# EAGLE design DevBCU_v1.0 (EAGLE 9.4.2)
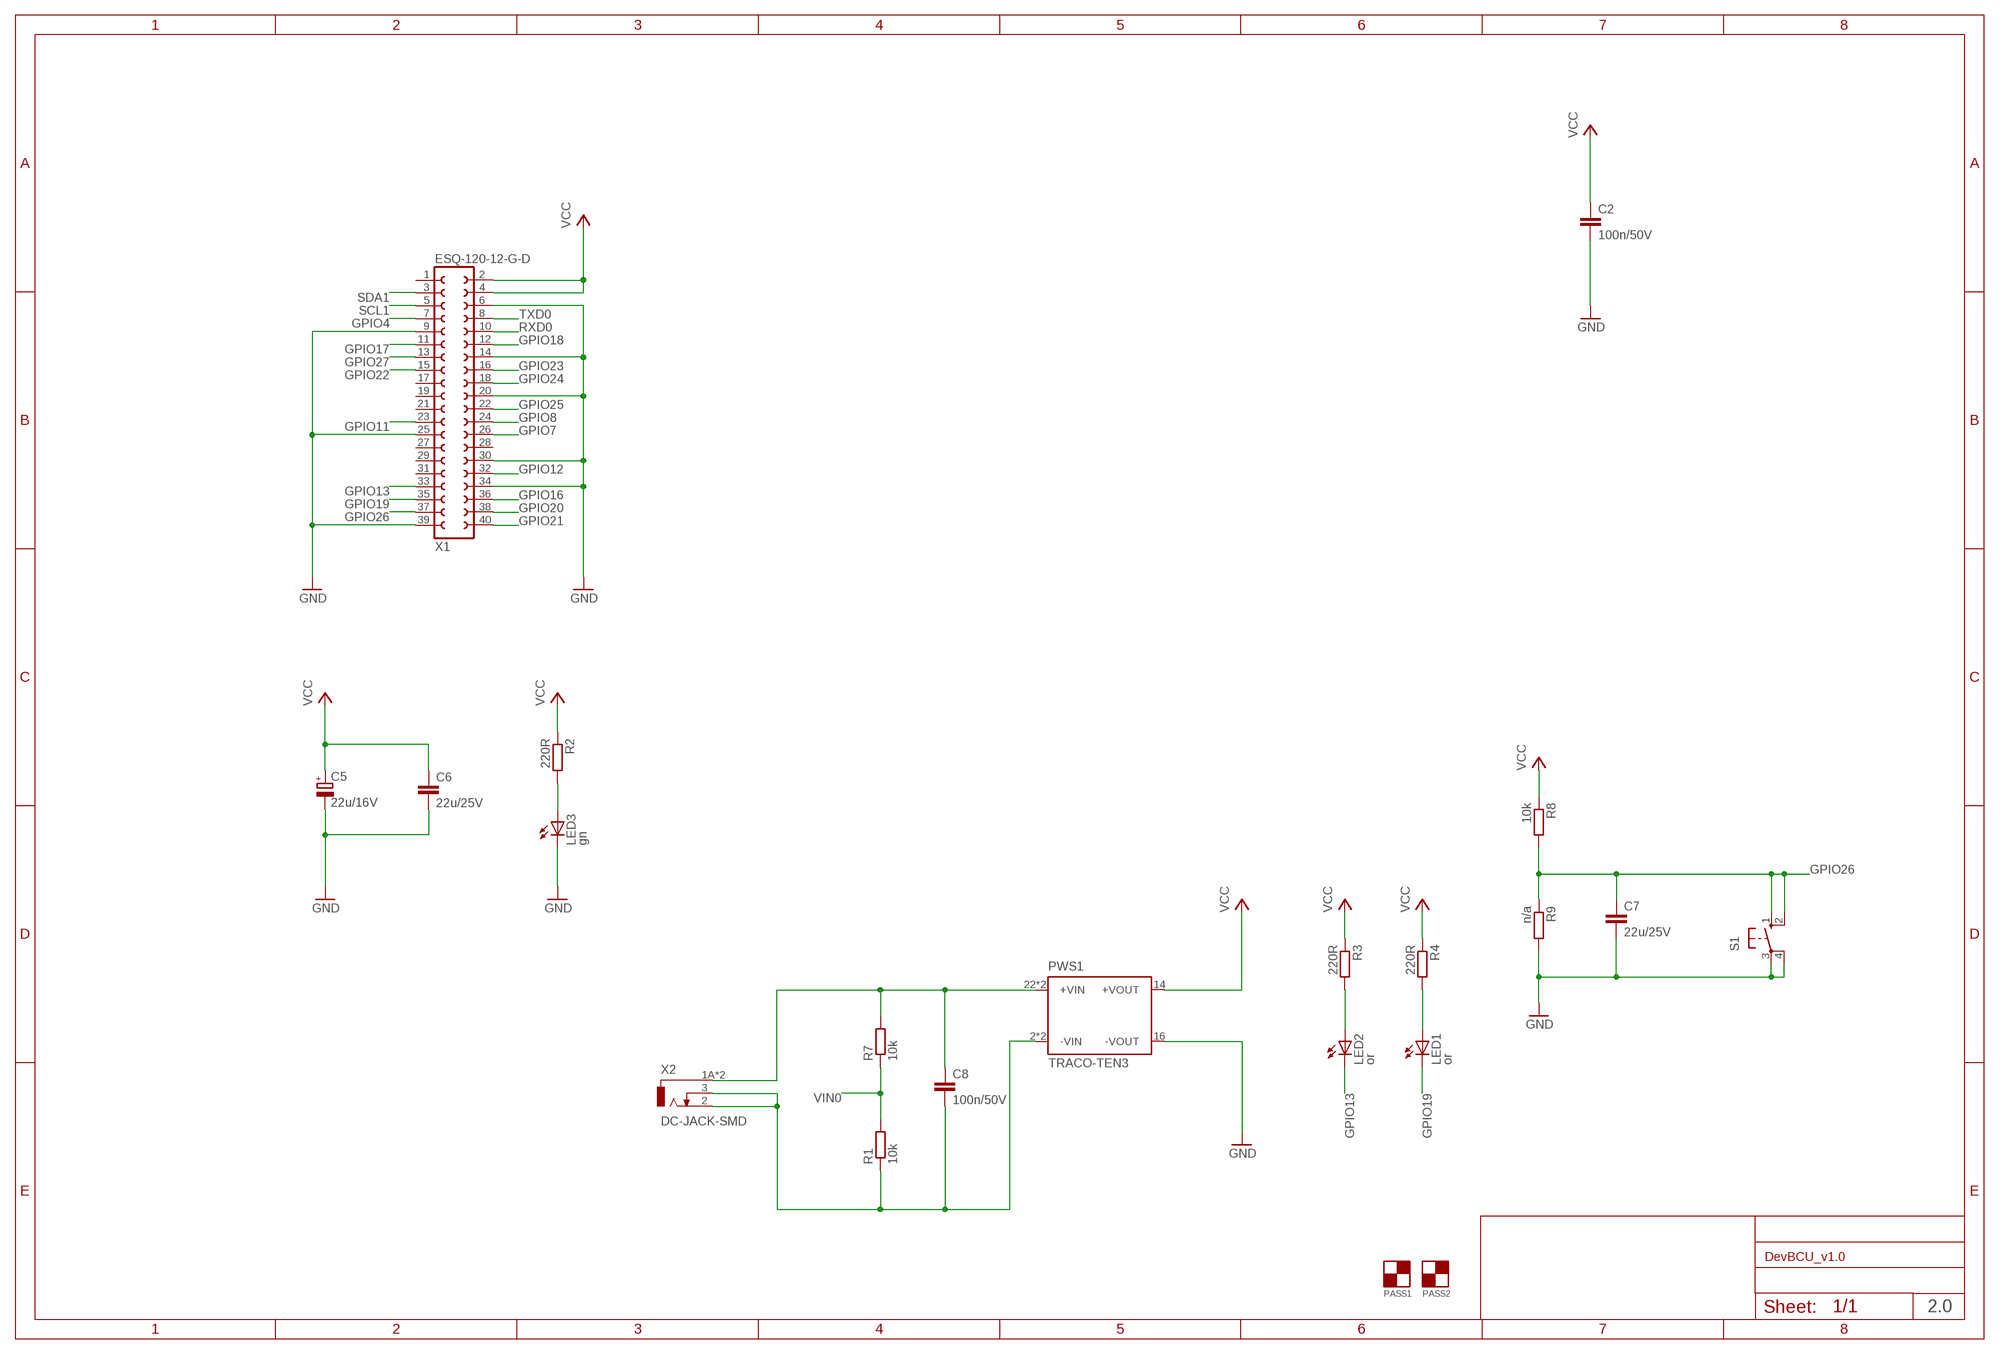
[diagram p0: schematic, sheet 1]

## Parts
C2  100n/50V  C-EUC0805  [C0805]
C5  22u/16V  CPOL-EUB/3528-21R  [B/3528-21R]
C6  22u/25V  C-EUC1210K  [C1210K]
C7  22u/25V  C-EUC1210K  [C1210K]
C8  100n/50V  C-EUC0805  [C0805]
LED1  or  LEDCHIP-LED0603  [CHIP-LED0603]
LED2  or  LEDCHIP-LED0603  [CHIP-LED0603]
LED3  gn  LEDCHIP-LED0603  [CHIP-LED0603]
PASS1  MAKR1  [MARK1]
PASS2  MAKR1  [MARK1]
PWS1  TRACO-TEN3  [TRACO_TEN_3]
R1  10k  R-EU_M0805  [M0805]
R2  220R  R-EU_R0805  [R0805]
R3  220R  R-EU_R0805  [R0805]
R4  220R  R-EU_R0805  [R0805]
R7  10k  R-EU_M0805  [M0805]
R8  10k  R-EU_R0805  [R0805]
R9  n/a  R-EU_R0805  [R0805]
S1  10-XXS  [B3FS-10XX]
X1  ESQ-120-12-G-D  FE20-2  [FE20-2]
X2  DC-JACK-SMD  [694_1XX_106_102]

## Nets
GND: C2.2 C5.- C6.2 C7.2 LED3.C PWS1.16(-VOUT) R9.2 S1.3(P) S1.4(P1) X1.6 X1.9 X1.14 X1.20 X1.25 X1.30 X1.34 X1.39
GPIO4: X1.7
GPIO7: X1.26
GPIO8: X1.24
GPIO11: X1.23
GPIO12: X1.32
GPIO13: LED2.C X1.33
GPIO16: X1.36
GPIO17: X1.11
GPIO18: X1.12
GPIO19: LED1.C X1.35
GPIO20: X1.38
GPIO21: X1.40
GPIO22: X1.15
GPIO23: X1.16
GPIO24: X1.18
GPIO25: X1.22
GPIO26: C7.1 R8.2 R9.1 S1.1(S) S1.2(S1) X1.37
GPIO27: X1.13
N$3: LED3.A R2.2
N$22: LED2.A R3.2
N$23: LED1.A R4.2
N$24: C8.1 PWS1.22(+VIN) PWS1.23(+VIN) R7.2 X2.1A X2.1B
N$26: C8.2 PWS1.2(-VIN) PWS1.3(-VIN) R1.1 X2.2 X2.3
RXD0: X1.10
SCL1: X1.5
SDA1: X1.3
TXD0: X1.8
VCC: C2.1 C5.+ C6.1 PWS1.14(+VOUT) R2.1 R3.1 R4.1 R8.1 X1.2 X1.4
VIN0: R1.2 R7.1
Unconnected: X1.1 X1.17 X1.19 X1.21 X1.27 X1.28 X1.29 X1.31

## Notes on the sheet
- 2.0

## Library data of the parts
C2 C6-C8 = rcl:C-EU: CAPACITOR, European symbol
C5 = rcl:CPOL-EU: POLARIZED CAPACITOR, European symbol
LED1-LED3 = led:LED: LED OSRAM: - CHIPLED LG R971, LG N971, LY N971, LG Q971, LY Q971, LO R971, LY R971 LH N974, LH R974 LS Q976, LO Q976, LY Q976 LO Q996 - Hyper CHIPLED LW Q18S LB Q993, LB Q99A, LB R99A - SideLED LS A670, LO A670, LY A670, LG A670, LP A670 LB A673, LV A673, LT A673, LW A673 LH A674 LY A675 LS A676, LA A676, LO A676, LY A676, LW A676 LS A679, LY A679, LG A679 - Hyper Micro SIDELED® LS Y876, LA Y876, LO Y876, LY Y876 LT Y87S - SmartLED LW L88C, LW L88S LB L89C, LB L89S, LG L890 LS L89K, LO L89K, LY L89K LS L896, LA L896, LO L896, LY L896 - TOPLED LS T670, LO T670, LY T670, LG T670, LP T670 LSG T670, LSP T670, LSY T670, LOP T670, LYG T670 LG T671, LOG T671, LSG T671 LB T673, LV T673, LT T673, LW T673 LH T674 LS T676, LA T676, LO T676, LY T676, LB T676, LH T676, LSB T676, LW T676 LB T67C, LV T67C, LT T67C, LS T67K, LO T67K, LY T67K, LW E67C LS E67B, LA E67B, LO E67B, LY E67B, LB E67C, LV E67C, LT E67C LW T67C LS T679, LY T679, LG T679 LS T770, LO T770, LY T770, LG T770, LP T770 LB T773, LV T773, LT T773, LW T773 LH T774 LS E675, LA E675, LY E675, LS T675 LS T776, LA T776, LO T776, LY T776, LB T776 LHGB T686 LT T68C, LB T68C - Hyper Mini TOPLED® LB M676 - Mini TOPLED Santana® LG M470 LS M47K, LO M47K, LY M47K Source: http://www.osram.convergy.de LUXEON: - LUMILED® LXK2-PW12-R00, LXK2-PW12-S00, LXK2-PW14-U00, LXK2-PW14-V00 LXK2-PM12-R00, LXK2-PM12-S00, LXK2-PM14-U00 LXK2-PE12-Q00, LXK2-PE12-R00, LXK2-PE12-S00, LXK2-PE14-T00, LXK2-PE14-U00 LXK2-PB12-K00, LXK2-PB12-L00, LXK2-PB12-M00, LXK2-PB14-N00, LXK2-PB14-P00, LXK2-PB14-Q00 LXK2-PR12-L00, LXK2-PR12-M00, LXK2-PR14-Q00, LXK2-PR14-R00 LXK2-PD12-Q00, LXK2-PD12-R00, LXK2-PD12-S00 LXK2-PH12-R00, LXK2-PH12-S00 LXK2-PL12-P00, LXK2-PL12-Q00, LXK2-PL12-R00 Source: www.luxeon.com KINGBRIGHT: KA-3528ASYC Source: www.kingbright.com
PASS1 PASS2 = pass-marks:MAKR1: Passmarke Kein elektrischer Anschluss, nur zur Ausrichtung auf LP
PWS1 = traco_electronic_ehp:TRACO: DC/DC-Konverter Autor: Peter Weissig Datum: 14.11.2013 Hersteller: Traco Power 1 x Input, 1 x Output
R1-R4 R7-R9 = rcl:R-EU_: RESISTOR, European symbol
S1 = switch_omron_ehp:10-XX: OMRON SWITCH Autor: Peter Weissig Datum: 20.02.2014 Hersteller: Omron
X1 = con-lsta:FE20-2: FEMALE HEADER; OC_FARNELL: unknown; OC_NEWARK: unknown
X2 = con-jack-rca:DC-JACK-SMD: DC Buchse 2,5mm rechtwinklig, Oberflächenmontage 5A 24 V dc, Gold, Zinn beschichtet RS Best.-Nr. 122-4878 Marke Wurth Elektronik Herst. Teile-Nr. 694106106102

## Net classes
0 default: clearance 0.178 mm

## Board
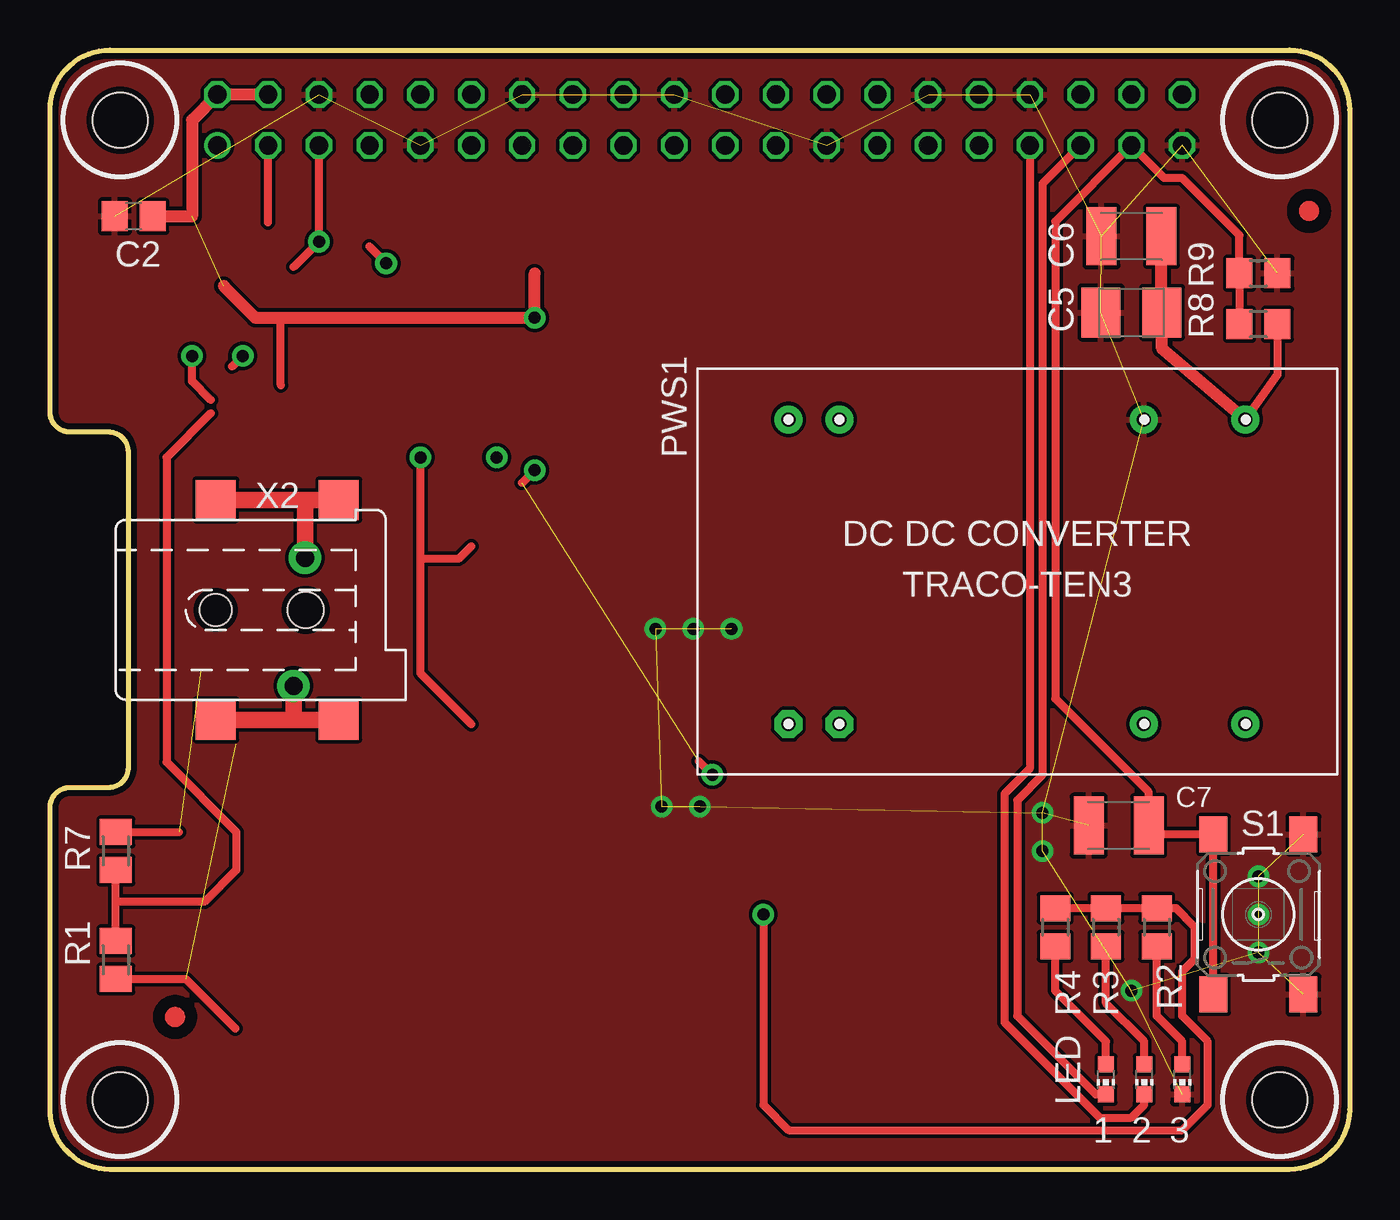
[diagram p1: board, top side]
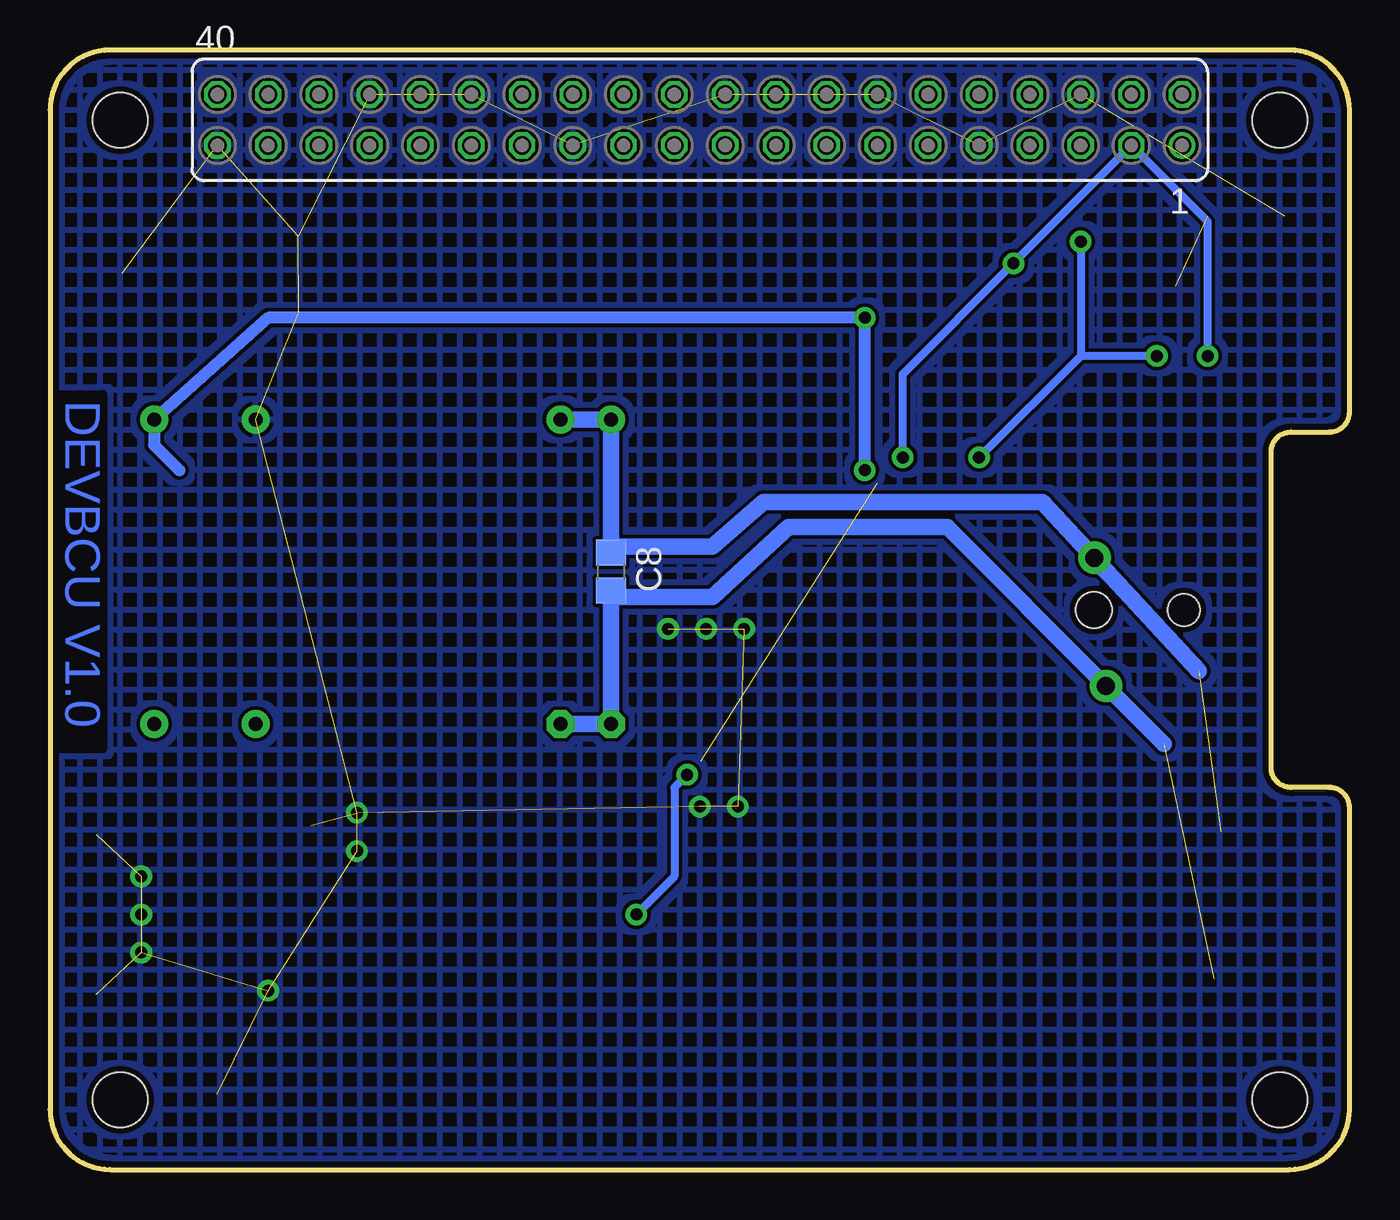
[diagram p2: board, bottom side, seen from below]

Size 65 x 56 mm. Coordinates in mm from the lower left corner, seen from the top.
Outline: 62,0 3,0 arc-90 0,3 0,18.11 arc-90 1,19.11 2.93,19.11 arc90 3.93,20.11 3.93,35.89 arc90 2.93,36.89 1,36.89 arc-90 0,37.89 0,53 arc-90 3,56 62,56 arc-90 65,53 65,3 arc-90 62,0
Copper layers (1*16): Top 0.035mm / dielectric 1.5mm / Bottom 0.035mm
Design rules "PCB-POOL Standard": minimum track width 0.15mm, minimum drill 0.3mm, track to track 0.15mm, track to pad 0.15mm, pad to pad 0.15mm, via to via 0.15mm, smd to smd 0.15mm, copper to edge 0.3mm, drill to drill 0.2mm, minimum pad ring 0.2mm, minimum via ring 0.15mm, stop-mask expansion 0.075mm, vias tented up to drill 0mil, thermal gap 0.2mm
Holes 2.75 mm at 3.5,52.5 61.5,52.5 3.5,52.5 61.5,52.5 61.5,3.5 3.5,3.5
bRestrict: area 62.3,21 to 64.9,38.8

### Footprints (pad centres in the part's own frame; a part is rotated, then mirrored left to right if it is on the bottom)
C0805 = smd 1.3 x 1.5: 1 -0.95,0; 2 0.95,0
B/3528-21R = smd 1.95 x 2.5: + 1.525,0; - -1.525,0
C1210K = smd 1.5 x 2.9: 1 -1.5,0; 2 1.5,0
CHIP-LED0603 = smd 0.8 x 0.8: A 0,-0.75; C 0,0.75
TRACO_TEN_3 = drill 0.7 pad 1.4 octagon: 2 -11.44,-7.62; 3 -8.9,-7.62 | drill 0.7 pad 1.4: 9 6.34,-7.62; 11 11.42,-7.62; 14 11.42,7.62; 16 6.34,7.62; 22 -8.9,7.62; 23 -11.44,7.62
M0805 = smd 1.3 x 1.6: 1 -0.95,0; 2 0.95,0
R0805 = smd 1.3 x 1.5: 1 -0.95,0; 2 0.95,0
B3FS-10XX = smd 1.8 x 1.4: 1 -4,2.25; 2 4,2.25; 3 -4,-2.25; 4 4,-2.25
FE20-2 = drill 0.914: 1 -24.13,1.27 | drill 0.914 octagon: 2 -24.13,-1.27; 3 -21.59,1.27; 4 -21.59,-1.27; 5 -19.05,1.27; 6 -19.05,-1.27; 7 -16.51,1.27; 8 -16.51,-1.27; 9 -13.97,1.27; 10 -13.97,-1.27; 11 -11.43,1.27; 12 -11.43,-1.27; 13 -8.89,1.27; 14 -8.89,-1.27; 15 -6.35,1.27; 16 -6.35,-1.27; 17 -3.81,1.27; 18 -3.81,-1.27; 19 -1.27,1.27; 20 -1.27,-1.27; 21 1.27,1.27; 22 1.27,-1.27; 23 3.81,1.27; 24 3.81,-1.27; 25 6.35,1.27; 26 6.35,-1.27; 27 8.89,1.27; 28 8.89,-1.27; 29 11.43,1.27; 30 11.43,-1.27; 31 13.97,1.27; 32 13.97,-1.27; 33 16.51,1.27; 34 16.51,-1.27; 35 19.05,1.27; 36 19.05,-1.27; 37 21.59,1.27; 38 21.59,-1.27; 39 24.13,1.27; 40 24.13,-1.27
694_1XX_106_102 = smd 2 x 2: 1A 5,5.5; 1B 11.15,5.5; 2 5,-5.5; 3 11.15,-5.5 | hole 1.6: 5,0 | hole 1.8: 9.5,0

### Placement (x,y rotation side)
C2  4.19,47.69 180 top
C5  54.09,42.87 0 top
C6  54.09,46.68 180 top
C7  53.45,17.2 180 top
C8  36.95,29.91 270 bottom
LED1  52.82,4.5 180 top
LED2  54.73,4.5 180 top
LED3  56.63,4.5 180 top
PASS1  62.98,47.95 0 top
PASS2  6.25,7.63 0 top
PWS1  48.38,29.91 0 top
R1  3.29,10.48 90 top
R2  55.36,12.12 270 top
R3  52.82,12.12 270 top
R4  50.28,12.12 270 top
R7  3.29,15.94 90 top
R8  60.44,42.29 180 top
R9  60.44,44.83 0 top
S1  60.44,12.76 90 top
X1  32.5,52.5 180 bottom
X2  3.29,28 0 top

### Tracks (layer width: path | path; a pad name or v marks a point on that pad's centre or on a via)
GND  (via drill 0.6)  (27 unrouted)
  other vias: 30.28,27.05 32.18,27.05 34.09,27.05 30.59,18.16 32.5,18.16 60.44,12.76 60.44,10.86 60.44,14.66 54.09,8.95 49.64,17.84 49.64,15.94
  pour Top: 62,0 3,0 arc-90 0,3 0,18.11 arc-90 1,19.11 2.93,19.11 arc90 3.93,20.11 3.93,35.89 arc90 2.93,36.89 1,36.89 arc-90 0,37.89 0,53 arc-90 3,56 62,56 arc-90 65,53 65,3 arc-90
  pour Bottom (hatched): 0,53 0,37.89 arc90 1,36.89 2.93,36.89 arc-90 3.93,35.89 3.93,20.11 arc-90 2.93,19.11 1,19.11 arc90 0,18.11 0,3 arc90 3,0 62,0 arc90 65,3 65,53 arc90 62,56 3,56 arc90
GPIO13
  Top 0.406: X1.33 49.01,20.06 47.74,18.79 47.74,7.36 52.5,2.6 54.09,2.6 54.73,3.23 LED2.C
GPIO19
  Top 0.406: X1.35 49.64,49.33 49.64,19.74 48.38,18.48 48.38,7.68 52.3,3.75 LED1.C
GPIO26
  Top 0.406: S1.1 S1.2 55.4,16.76 C7.1 54.95,18.88 50.28,23.55 50.28,47.42 X1.37 55.73,49.59 56.63,49.59 59.49,46.73 R9.1 R8.2
N$3
  Top 0.406: LED3.A 56.63,6.41 55.36,7.68 R2.2
N$22
  Top 0.406: LED2.A 54.73,6.41 52.82,8.32 R3.2
N$23
  Top 0.406: LED1.A 52.82,6.41 50.28,8.95 R4.2
N$24  (via drill 0.9)  (1 unrouted)
  Top 0.406: R7.2 6.45,16.88
  Top 0.813: X2.1A 12.76,33.5 | 12.76,33.5 v12.76,30.59 | X2.1B 12.76,33.5
  Bottom 0.813: PWS1.22 PWS1.23 36.94,30.87 C8.1 36.62,31.18 31.86,31.18 29.32,33.4 15.36,33.4 v12.76,30.59 | 7.54,24.94 11.57,29.3 | 11.57,29.3 v12.76,30.59 | v12.76,30.59 12.76,30.49 11.57,29.3
N$26  (via drill 0.9)  (1 unrouted)
  Top 0.406: R1.1 6.8,9.54 9.29,7.05
  Top 0.813: X2.2 12.18,22.5 | 12.18,22.5 v12.18,24.19 | X2.3 12.18,22.5
  Bottom 0.813: PWS1.3 PWS1.2 36.94,28.95 C8.2 36.62,28.64 31.86,28.64 28.05,32.13 20.12,32.13 v12.18,24.19 9.29,21.3
SCL1  (via drill 0.6)
  Top 0.406: 21.07,22.29 18.53,24.82 18.53,30.54 | 21.07,31.18 20.44,30.54 18.53,30.54 | 18.53,30.54 v18.53,35.62 | X1.5 13.45,48.62 v13.45,46.41 12.18,45.14 | 9.11,40.17 v9.64,40.7
  Bottom 0.406: v13.45,46.41 13.45,40.7 | 13.45,40.7 v18.53,35.62 | v9.64,40.7 13.45,40.7
SDA1  (via drill 0.6)
  Top 0.406: 10.91,47.37 X1.3 | 15.96,46.17 v16.81,45.33 | 8.04,38.49 7.1,39.43 v7.1,40.7
  Bottom 0.406: v22.34,35.62 22.34,39.8 v16.81,45.33 X1.3 7.1,47.42 v7.1,40.7
VCC  (via drill 0.6)  (2 unrouted)
  Top 0.406: 23.61,34.35 v24.24,34.98 | R4.1 R3.1 R2.1 56.31,13.07 56.31,13.08 57.27,12.12 57.27,10.54 56.63,9.9 56.63,7.68 57.9,6.41 57.9,3.23 56.63,1.96 36.95,1.96 35.67,3.23 v35.67,12.76 | 32.45,20.43 v33.13,19.74 | 11.55,39.23 11.55,42.61 | R8.1 61.39,39.76 PWS1.14
  Top 0.61: PWS1.14 55.61,41.07 C5.+ 55.59,42.89 C6.1 | C2.1 7.1,47.69 7.1,52.5 X1.2 X1.4 | 8.69,44.19 10.27,42.61 11.55,42.61 v24.24,42.61 24.24,44.83
  Bottom 0.406: v33.13,19.74 33.77,19.11 33.77,14.66 v35.67,12.76
  Bottom 0.61: 58.53,34.98 59.8,36.24 PWS1.14 54.08,42.61 v24.24,42.61 v24.24,34.98
VIN0
  Top 0.406: R1.2 3.29,13.39 | 3.29,13.39 R7.1 | 8.04,37.83 5.83,35.62 5.83,20.38 9.32,16.89 9.32,14.98 7.73,13.39 3.29,13.39

### Text on the board
Bottom: DEVBCU V1.0
tNames: DevBCU v1.0 | 2019 Ruemmler, Elias | LED | 1 | 2 | 3